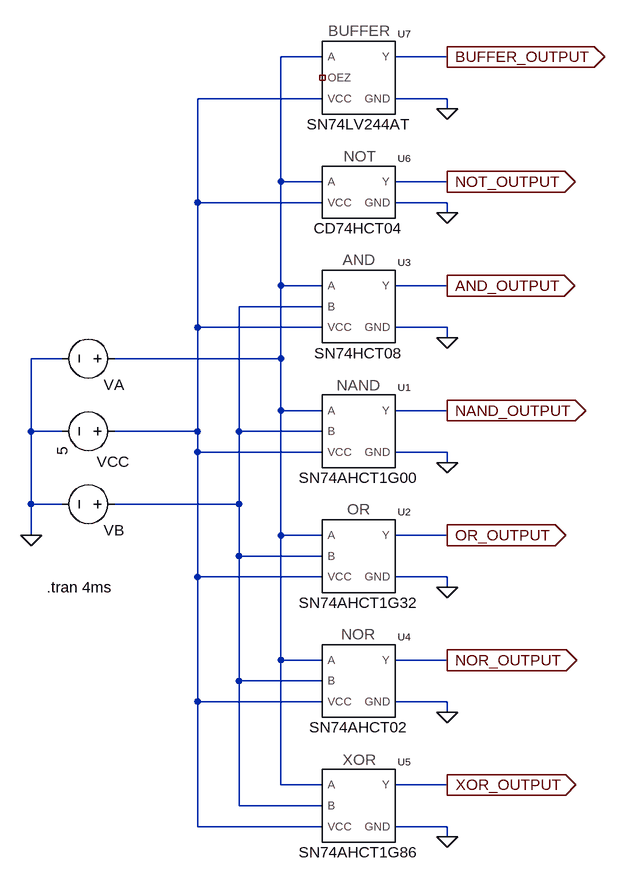
[diagram p0: schematic Gates.asc]
Gates.asc, the LTspice schematic file:
Version 4.1
SHEET 1 1304 1160
WIRE 256 -80 192 -80
WIRE 448 -80 368 -80
WIRE 256 -16 64 -16
WIRE 448 -16 368 -16
WIRE 448 0 448 -16
WIRE 192 112 192 -80
WIRE 256 112 192 112
WIRE 448 112 368 112
WIRE 64 144 64 -16
WIRE 256 144 64 144
WIRE 448 144 368 144
WIRE 448 160 448 144
WIRE 192 272 192 112
WIRE 256 272 192 272
WIRE 448 272 368 272
WIRE 256 304 128 304
WIRE 64 336 64 144
WIRE 256 336 64 336
WIRE 448 336 368 336
WIRE 448 352 448 336
WIRE -144 384 -192 384
WIRE 192 384 192 272
WIRE 192 384 -64 384
WIRE 192 464 192 384
WIRE 256 464 192 464
WIRE 448 464 368 464
WIRE -192 496 -192 384
WIRE -144 496 -192 496
WIRE 64 496 64 336
WIRE 64 496 -64 496
WIRE 128 496 128 304
WIRE 256 496 128 496
WIRE 64 528 64 496
WIRE 256 528 64 528
WIRE 448 528 368 528
WIRE 448 544 448 528
WIRE -192 608 -192 496
WIRE -144 608 -192 608
WIRE 128 608 128 496
WIRE 128 608 -64 608
WIRE -192 656 -192 608
WIRE 192 656 192 464
WIRE 256 656 192 656
WIRE 448 656 368 656
WIRE 128 688 128 608
WIRE 256 688 128 688
WIRE 64 720 64 528
WIRE 256 720 64 720
WIRE 448 720 368 720
WIRE 448 736 448 720
WIRE 192 848 192 656
WIRE 256 848 192 848
WIRE 448 848 368 848
WIRE 128 880 128 688
WIRE 256 880 128 880
WIRE 64 912 64 720
WIRE 256 912 64 912
WIRE 448 912 368 912
WIRE 448 928 448 912
WIRE 192 1040 192 848
WIRE 256 1040 192 1040
WIRE 448 1040 368 1040
WIRE 128 1072 128 880
WIRE 256 1072 128 1072
WIRE 64 1104 64 912
WIRE 256 1104 64 1104
WIRE 448 1104 368 1104
WIRE 448 1120 448 1104
FLAG -192 656 0
FLAG 448 544 0
FLAG 448 464 NAND_OUTPUT
IOPIN 448 464 Out
FLAG 448 736 0
FLAG 448 656 OR_OUTPUT
IOPIN 448 656 Out
FLAG 448 352 0
FLAG 448 272 AND_OUTPUT
IOPIN 448 272 Out
FLAG 448 928 0
FLAG 448 848 NOR_OUTPUT
IOPIN 448 848 Out
FLAG 448 1120 0
FLAG 448 1040 XOR_OUTPUT
IOPIN 448 1040 Out
FLAG 448 0 0
FLAG 448 160 0
FLAG 448 112 NOT_OUTPUT
IOPIN 448 112 Out
FLAG 448 -80 BUFFER_OUTPUT
IOPIN 448 -80 Out
SYMBOL voltage -48 384 R90
WINDOW 3 24 96 Invisible 2
WINDOW 123 0 0 Left 0
WINDOW 39 0 0 Left 0
WINDOW 0 40 1 VRight 2
SYMATTR Value PULSE(0 5 0 1fs 1fs 2ms 4ms)
SYMATTR InstName VA
SYMBOL voltage -48 608 R90
WINDOW 3 24 96 Invisible 2
WINDOW 123 0 0 Left 0
WINDOW 39 0 0 Left 0
WINDOW 0 40 1 VRight 2
SYMATTR Value PULSE(0 5 0 1fs 1fs 1ms 2ms)
SYMATTR InstName VB
SYMBOL voltage -48 496 R90
WINDOW 123 0 0 Left 0
WINDOW 39 0 0 Left 0
WINDOW 0 47 -7 VRight 2
SYMATTR InstName VCC
SYMATTR Value 5
SYMBOL OR 304 688 R0
SYMATTR InstName U2
SYMBOL NAND 304 496 R0
SYMATTR InstName U1
SYMBOL AND 304 304 R0
SYMATTR InstName U3
SYMBOL NOR 304 880 R0
SYMATTR InstName U4
SYMBOL XOR 304 1072 R0
SYMATTR InstName U5
SYMBOL NOT 304 128 R0
SYMATTR InstName U6
SYMBOL BUFFER 304 -48 R0
SYMATTR InstName U7
TEXT -168 736 Left 2 !.tran 4ms

The netlist it stands for:
* Gates.asc
VA N001 0 PULSE(0 5 0 1fs 1fs 2ms 4ms)
VB N003 0 PULSE(0 5 0 1fs 1fs 1ms 2ms)
VCC N002 0 5
X§U2 OR_OUTPUT N001 N003 N002 0 SN74AHCT1G32  ; pins Y A B VCC GND
X§U1 NAND_OUTPUT N001 N003 N002 0 SN74AHCT1G00  ; pins Y A B VCC GND
X§U3 AND_OUTPUT N001 N003 N002 0 SN74HCT08  ; pins Y A B VCC GND
X§U4 NOR_OUTPUT N001 N003 N002 0 SN74AHCT02  ; pins Y A B VCC GND
X§U5 XOR_OUTPUT N001 N003 N002 0 SN74AHCT1G86  ; pins Y A B VCC GND
X§U6 NOT_OUTPUT N001 N002 0 CD74HCT04  ; pins Y A VCC GND
X§U7 BUFFER_OUTPUT N001 NC_01 N002 0 SN74LV244AT  ; pins Y A OEZ VCC GND
.tran 4ms
.lib C:\Users\josea\OneDrive\Escritorio\Andres\TEC\2025 - Semestre I\Fundamentos de arquitectura de computadores\Taller 1 - Compuertas y consideraciones electricas\OR-SN74AHCT1G32.cir
.lib C:\Users\josea\OneDrive\Escritorio\Andres\TEC\2025 - Semestre I\Fundamentos de arquitectura de computadores\Taller 1 - Compuertas y consideraciones electricas\NAND-SN74AHCT1G00.cir
.lib C:\Users\josea\OneDrive\Escritorio\Andres\TEC\2025 - Semestre I\Fundamentos de arquitectura de computadores\Taller 1 - Compuertas y consideraciones electricas\AND-SN74HCT08.cir
.lib C:\Users\josea\OneDrive\Escritorio\Andres\TEC\2025 - Semestre I\Fundamentos de arquitectura de computadores\Taller 1 - Compuertas y consideraciones electricas\NOR-SN74AHCT02.cir
.lib C:\Users\josea\OneDrive\Escritorio\Andres\TEC\2025 - Semestre I\Fundamentos de arquitectura de computadores\Taller 1 - Compuertas y consideraciones electricas\XOR-SN74AHCT1G86.cir
.lib C:\Users\josea\OneDrive\Escritorio\Andres\TEC\2025 - Semestre I\Fundamentos de arquitectura de computadores\Taller 1 - Compuertas y consideraciones electricas\NOT-CD74HCT04.cir
.lib C:\Users\josea\OneDrive\Escritorio\Andres\TEC\2025 - Semestre I\Fundamentos de arquitectura de computadores\Taller 1 - Compuertas y consideraciones electricas\BUFFER-SN74LV244AT.cir
.backanno
.end

* Results of the author's LTspice run, read from the files saved beside the schematic
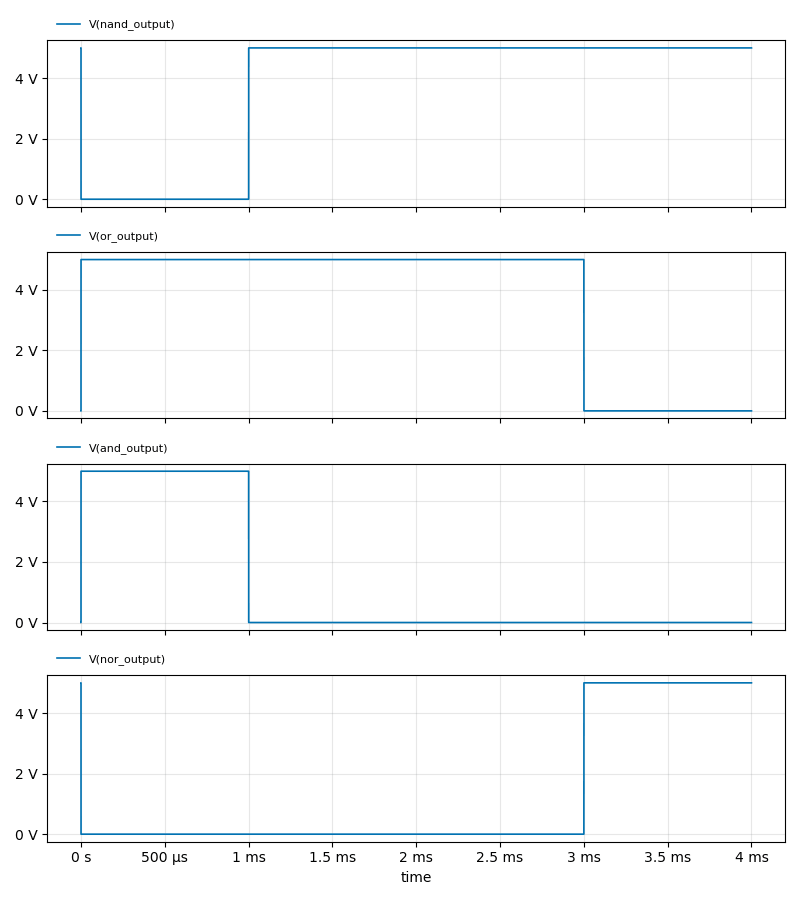
[diagram p1: Transient Analysis of Gates.asc, plotted from the saved traces]
* Transient Analysis, 1 run:
*   V(nand_output): min 0 V, max 5 V, average 3.75 V, rms 4.33 V, last 5 V
*   V(or_output): min 0 V, max 5 V, average 3.75 V, rms 4.33 V, last 0 V
*   V(and_output): min 0 V, max 5 V, average 1.25 V, rms 2.5 V, last 0 V
*   V(nor_output): min 0 V, max 5 V, average 1.25 V, rms 2.5 V, last 5 V